# EAGLE schematic mdx-user-box (EAGLE 9.0.1)
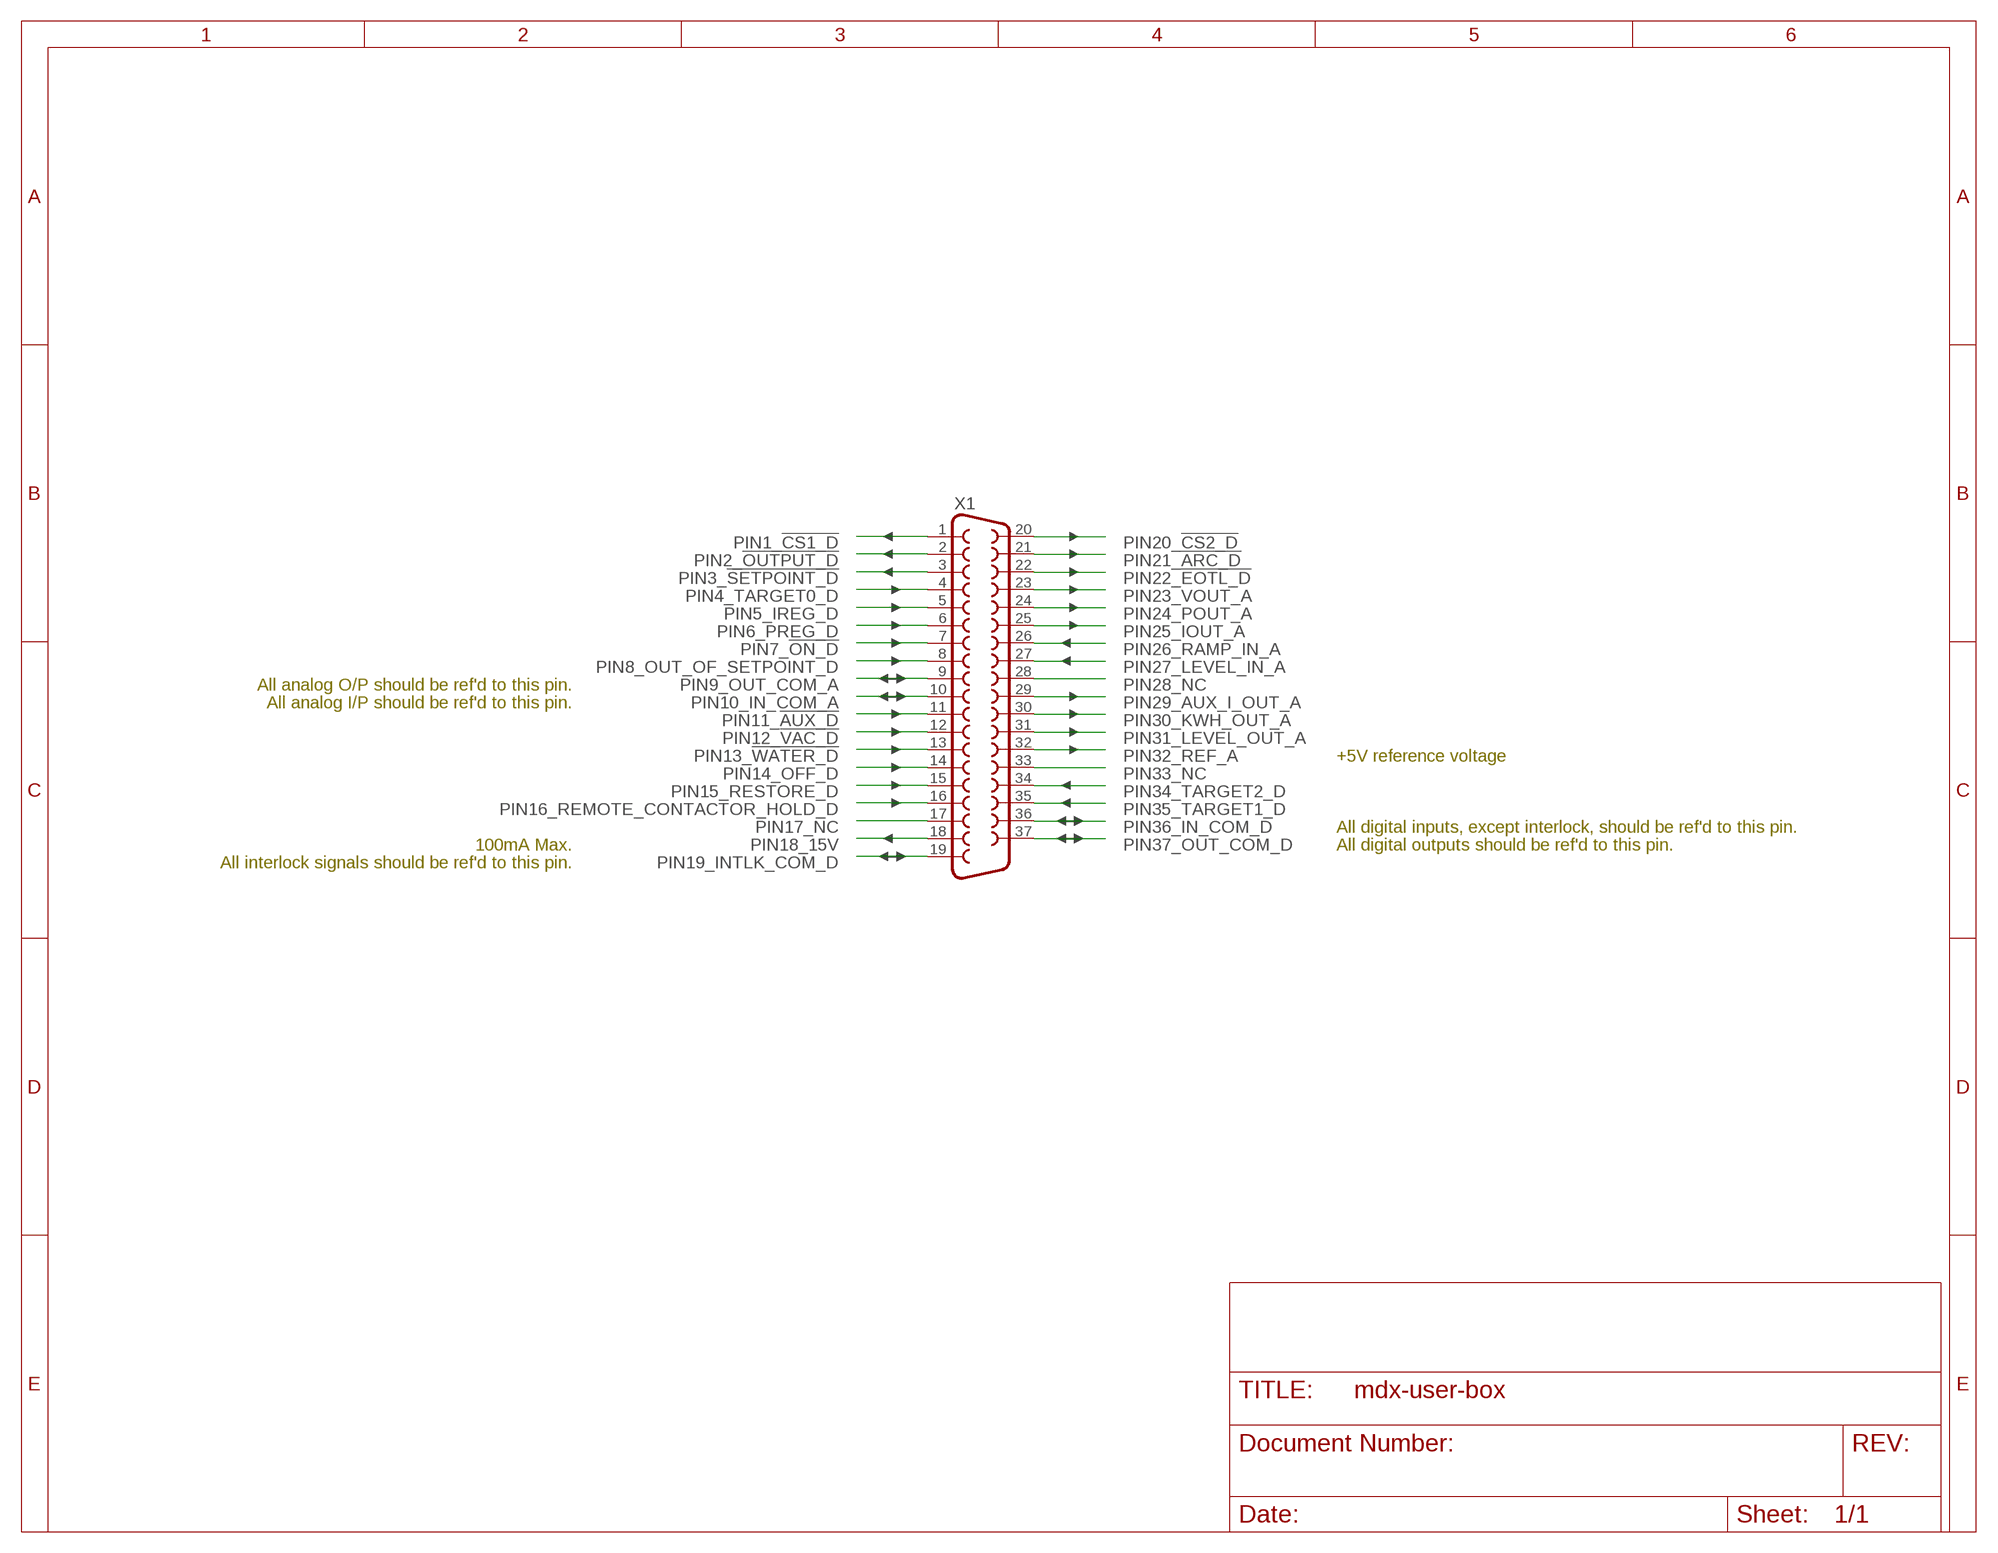
[diagram p0: schematic, sheet 1]

## Parts
X1  F37HP  [F37HP]

## Nets
PIN1_!CS1_D: X1.1
PIN2_!OUTPUT_D: X1.2
PIN3_!SETPOINT_D: X1.3
PIN4_TARGET0_D: X1.4
PIN5_IREG_D: X1.5
PIN6_PREG_D: X1.6
PIN7_!ON_D: X1.7
PIN8_OUT_OF_SETPOINT_D: X1.8
PIN9_OUT_COM_A: X1.9
PIN10_IN_COM_A: X1.10
PIN11_!AUX_D: X1.11
PIN12_!VAC_D: X1.12
PIN13_!WATER_D: X1.13
PIN14_OFF_D: X1.14
PIN15_RESTORE_D: X1.15
PIN16_REMOTE_CONTACTOR_HOLD_D: X1.16
PIN17_NC: X1.17
PIN18_15V: X1.18
PIN19_INTLK_COM_D: X1.19
PIN20_!CS2_D: X1.20
PIN21_!ARC_D: X1.21
PIN22_!EOTL_D: X1.22
PIN23_VOUT_A: X1.23
PIN24_POUT_A: X1.24
PIN25_IOUT_A: X1.25
PIN26_RAMP_IN_A: X1.26
PIN27_LEVEL_IN_A: X1.27
PIN28_NC: X1.28
PIN29_AUX_I_OUT_A: X1.29
PIN30_KWH_OUT_A: X1.30
PIN31_LEVEL_OUT_A: X1.31
PIN32_REF_A: X1.32
PIN33_NC: X1.33
PIN34_TARGET2_D: X1.34
PIN35_TARGET1_D: X1.35
PIN36_IN_COM_D: X1.36
PIN37_OUT_COM_D: X1.37

## Notes on the sheet
- All analog O/P should be ref'd to this pin.
- All analog I/P should be ref'd to this pin.
- +5V reference voltage
- All digital inputs, except interlock, should be ref'd to this pin.
- 100mA Max. | All digital outputs should be ref'd to this pin.
- All interlock signals should be ref'd to this pin.

## Library data of the parts
X1 = con-subd:F37: SUB-D; OC_FARNELL: unknown; OC_NEWARK: unknown